# EAGLE design Taciturn_Fuzz (EAGLE 9.6.0)
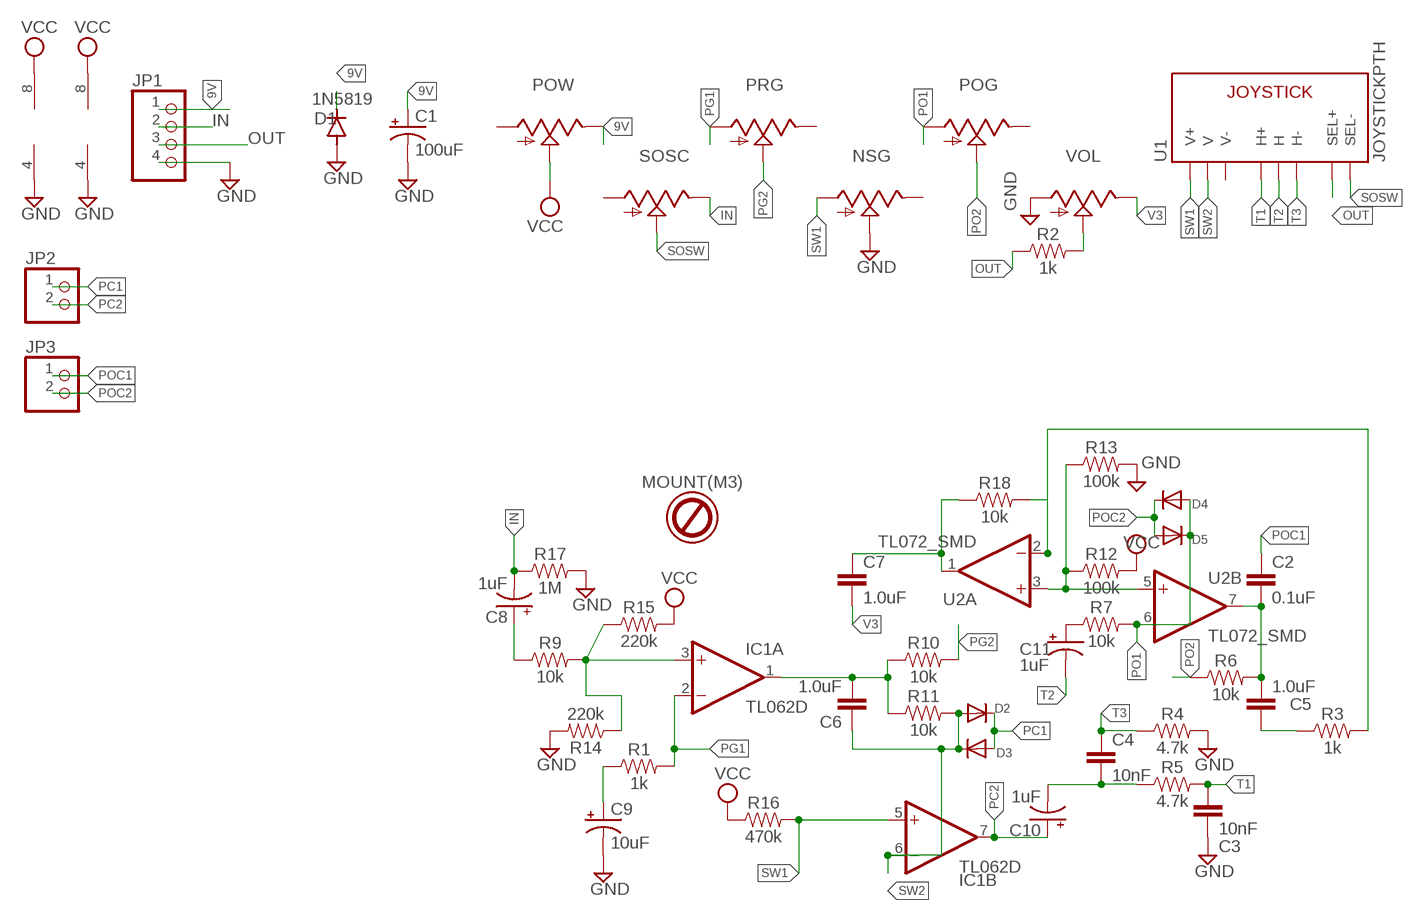
[diagram p0: schematic, sheet 1]

## Parts
C1  100uF  CAP_SMD+THRUPAN_B  [PAN_B_SMD+THRU]
C2  0.1uF  0.1UF-0603-25V-(+80/-20%)  [0603]
C3  10nF  10NF-0603-50V-10%  [0603]
C4  10nF  10NF-0603-50V-10%  [0603]
C5  1.0uF  1.0UF-0603-16V-10%  [0603]
C6  1.0uF  1.0UF-0603-16V-10%  [0603]
C7  1.0uF  1.0UF-0603-16V-10%  [0603]
C8  1uF  CAP_SMD+THRUPAN_B  [PAN_B_SMD+THRU]
C9  10uF  CAP_SMD+THRUPAN_B  [PAN_B_SMD+THRU]
C10  1uF  CAP_SMD+THRUPAN_B  [PAN_B_SMD+THRU]
C11  1uF  CAP_SMD+THRUPAN_B  [PAN_B_SMD+THRU]
D1  1N5819  DIODE-SOD123  [SOD123]
D2  DIODESMA  [SMADIODE]
D3  DIODESMA  [SMADIODE]
D4  DIODESMA  [SMADIODE]
D5  DIODESMA  [SMADIODE]
IC1  TL062D  [SO08]
JP1  PINHD-1X4  [1X04]
JP2  PINHD-1X2  [1X02]
JP3  PINHD-1X2  [1X02]
NSG  9MM_SNAP-IN_POT_  [9MM_SNAP-IN_POT]
O1  MOUNT(M3)  [HOLE-3.5MM]
POG  9MM_SNAP-IN_POT_  [9MM_SNAP-IN_POT]
POW  9MM_SNAP-IN_POT_  [9MM_SNAP-IN_POT]
PRG  9MM_SNAP-IN_POT_  [9MM_SNAP-IN_POT]
R1  1k  1KOHM-0603-1/10W-1%  [0603]
R2  1k  1KOHM-0603-1/10W-1%  [0603]
R3  1k  1KOHM-0603-1/10W-1%  [0603]
R4  4.7k  4.7KOHM-0603-1/10W-1%  [0603]
R5  4.7k  4.7KOHM-0603-1/10W-1%  [0603]
R6  10k  10KOHM-0603-1/10W-1%  [0603]
R7  10k  10KOHM-0603-1/10W-1%  [0603]
R9  10k  10KOHM-0603-1/10W-1%  [0603]
R10  10k  10KOHM-0603-1/10W-1%  [0603]
R11  10k  10KOHM-0603-1/10W-1%  [0603]
R12  100k  100KOHM-0603-1/10W-1%  [0603]
R13  100k  100KOHM-0603-1/10W-1%  [0603]
R14  220k  220KOHM-0603-1/10W-1%  [0603]
R15  220k  220KOHM-0603-1/10W-1%  [0603]
R16  470k  470OHM-0603-1/10W-1%  [0603]
R17  1M  1MOHM-0603-1/4W-5%  [0603]
R18  10k  10KOHM-0603-1/10W-1%  [0603]
SOSC  9MM_SNAP-IN_POT_  [9MM_SNAP-IN_POT]
U1  JOYSTICKPTH  [JOYSTICK]
U2  TL072_SMD  [SO08]
VOL  9MM_SNAP-IN_POT_  [9MM_SNAP-IN_POT]

## Nets
9V: C1.+ C1.++(+) D1.C JP1.1 POW.3(E)
GND: C1.- C1.--(-) C3.2 C9.- C9.--(-) D1.A IC1.4(P:V-) JP1.4 NSG.2(S) R4.2 R13.2 R14.2 R17.2 U2.4(P:V-) VOL.1(A)
IN: C8.- C8.--(-) JP1.2 R17.1 SOSC.3(E)
N$1: R3.2 R18.2 U2.2(A:-IN)
N$2: C8.+ C8.++(+) R9.1
N$3: IC1.3(A:+IN) R9.2 R14.1 R15.1
N$4: C9.+ C9.++(+) R1.1
N$5: C6.2 IC1.1(A:OUT) R10.1 R11.1
N$6: C4.2 C10.- C10.--(-) R5.1
N$7: C11.+ C11.++(+) R7.1
N$8: C2.2 C5.1 R6.2 U2.7(B:OUT)
N$9: C5.2 R3.1
N$10: R12.1 R13.1 U2.3(A:+IN) U2.5(B:+IN)
N$11: C7.1 R18.1 U2.1(A:OUT)
OUT: JP1.3 R2.1 U1.B1A(SEL+)
PC1: D2.C D3.A JP2.1
PC2: C10.+ C10.++(+) IC1.7(B:OUT) JP2.2
PG1: IC1.2(A:-IN) PRG.1(A) R1.2
PG2: PRG.2(S) R10.2
PO1: D4.A D5.C POG.1(A) R7.2 U2.6(B:-IN)
PO2: POG.2(S) R6.1
POC1: C2.1 JP3.1
POC2: D4.C D5.A JP3.2
SOSW: SOSC.2(S) U1.B2A(SEL-)
SW1: IC1.5(B:+IN) NSG.1(A) R16.2 U1.V1(V+)
SW2: C6.1 D2.A D3.C IC1.6(B:-IN) R11.2 U1.V2(V)
T1: C3.1 R5.2 U1.H1(H+)
T2: C11.- C11.--(-) U1.H2(H)
T3: C4.1 R4.1 U1.H3(H-)
V2: R2.2 VOL.2(S)
V3: C7.2 VOL.3(E)
VCC: IC1.8(P:V+) POW.2(S) R12.2 R15.2 R16.1 U2.8(P:V+)
Unconnected: NSG.3(E) O1.MNT POG.3(E) POW.1(A) PRG.3(E) SOSC.1(A) U1.V3(V-)

## Library data of the parts
C1 C8-C11 = MusicThingModular:CAP_SMD+THRU
C2 = SparkFun-Capacitors:0.1UF: 0.1µF ceramic capacitors A capacitor is a passive two-terminal electrical component used to store electrical energy temporarily in an electric field.; PROD_ID: CAP-00810
C3 C4 = SparkFun-Capacitors:10NF: 0.01uF/10nF/10,000pF ceramic capacitors A capacitor is a passive two-terminal electrical component used to store electrical energy temporarily in an electric field. CAP-09321; PROD_ID: CAP-00867
C5-C7 = SparkFun-Capacitors:1.0UF: 1µF ceramic capacitors A capacitor is a passive two-terminal electrical component used to store electrical energy temporarily in an electric field.; PROD_ID: CAP-00868
D1 = diode:DIODE-: DIODE
D2-D5 = adafruit:DIODE: Diode SMADIODE - SMA Surface Mount Package 20V 1A Schottky Diode Digikey: 641-1014-6-ND DO-1N4148 - Through Hole Small Current Diode SOD-123 20V 1 A (.5mV Vf) Schottky Diode - Digikey: MBRX120TPMSCT-ND SOD-323 10V 570mA (.38mV Vf, 3ns) Schottky Diode - Digikey: ZLLS410CT-ND SOD-523 30V 30mA Schottky Diode (RB751S-40TE61) - Digikey: RB751S-40TE61CT-ND SOT23-R/W - SOT23 Package (R = Solder Paste/Reflow Ovens, W = Hand-Soldering) BAT54Film 40V 300mA - Digikey: 497-7162-1-ND
IC1 = linear:TL062: OP AMP
JP1 = Connector:PINHD-1X4: PIN HEADER; CATEGORY: CONNECTOR; SUB-CATEGORY: PIN-HEADER
JP2 JP3 = pinhead:PINHD-1X2: PIN HEADER
NSG POG POW PRG SOSC VOL = MusicThingModular:9MM_SNAP-IN_POT: 9mm vertical snap-in pot, Alpha / Panasonic style
O1 = hardware:MOUNT(?)
R1-R3 = SparkFun-Resistors:1KOHM: 1kΩ resistor A resistor is a passive two-terminal electrical component that implements electrical resistance as a circuit element. Resistors act to reduce current flow, and, at the same time, act to lower voltage levels within circuits. - Wikipedia; PROD_ID: RES-07856
R4 R5 = SparkFun-Resistors:4.7KOHM: 4.7kΩ resistor A resistor is a passive two-terminal electrical component that implements electrical resistance as a circuit element. Resistors act to reduce current flow, and, at the same time, act to lower voltage levels within circuits. - Wikipedia; PROD_ID: RES-07857
R6 R7 R9-R11 R18 = SparkFun-Resistors:10KOHM: 10kΩ resistor A resistor is a passive two-terminal electrical component that implements electrical resistance as a circuit element. Resistors act to reduce current flow, and, at the same time, act to lower voltage levels within circuits. - Wikipedia; PROD_ID: RES-00824
R12 R13 = SparkFun-Resistors:100KOHM: 100kΩ resistor A resistor is a passive two-terminal electrical component that implements electrical resistance as a circuit element. Resistors act to reduce current flow, and, at the same time, act to lower voltage levels within circuits. - Wikipedia; PROD_ID: RES-07828
R14 R15 = SparkFun-Resistors:220KOHM: 220kΩ resistor A resistor is a passive two-terminal electrical component that implements electrical resistance as a circuit element. Resistors act to reduce current flow, and, at the same time, act to lower voltage levels within circuits. - Wikipedia; PROD_ID: RES-08969
R16 = SparkFun-Resistors:470OHM: 470Ω resistor A resistor is a passive two-terminal electrical component that implements electrical resistance as a circuit element. Resistors act to reduce current flow, and, at the same time, act to lower voltage levels within circuits. - Wikipedia; PROD_ID: RES-07869; VALUE: 470
R17 = SparkFun-Resistors:1MOHM: 1MΩ resistor A resistor is a passive two-terminal electrical component that implements electrical resistance as a circuit element. Resistors act to reduce current flow, and, at the same time, act to lower voltage levels within circuits. - Wikipedia; PROD_ID: RES-07868
U1 = SparkFun-Electromechanical:JOYSTICK: Thumb Joystick Joystick commonly found in PS2 controllers. Two pots and a select switch. Footprint proven. Spark Fun Electronics SKU : COM-09032
U2 = MusicThingModular:TL072: Generic Dual Op Amp

## Board
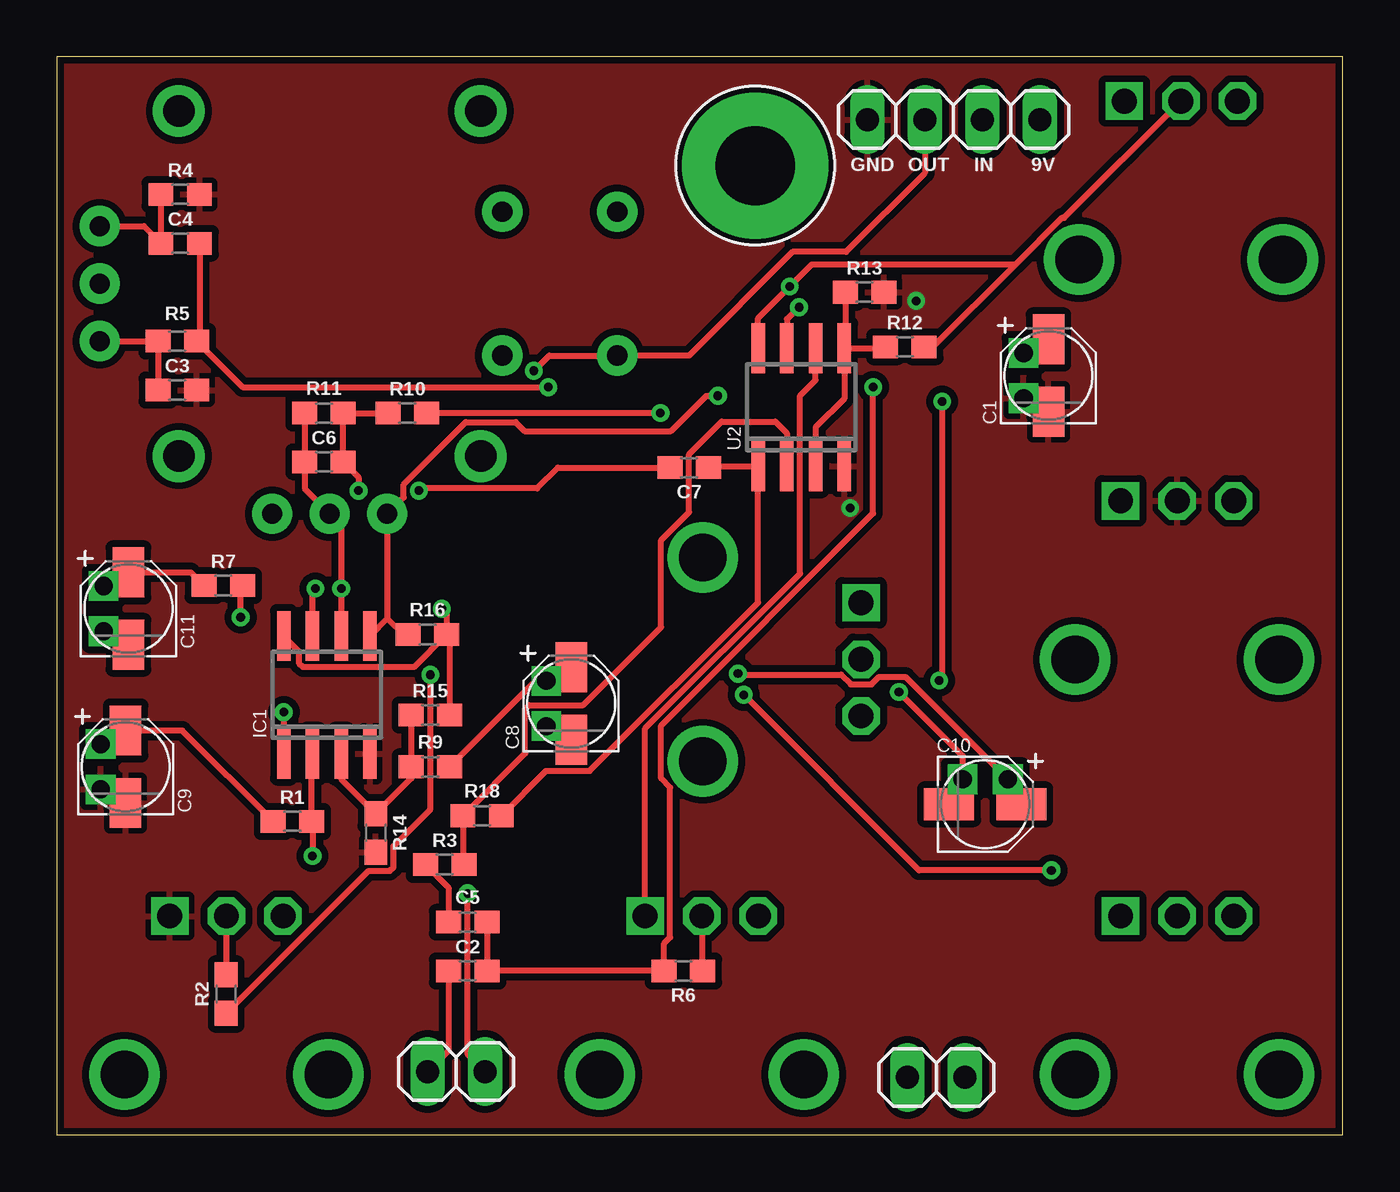
[diagram p1: board, top side]
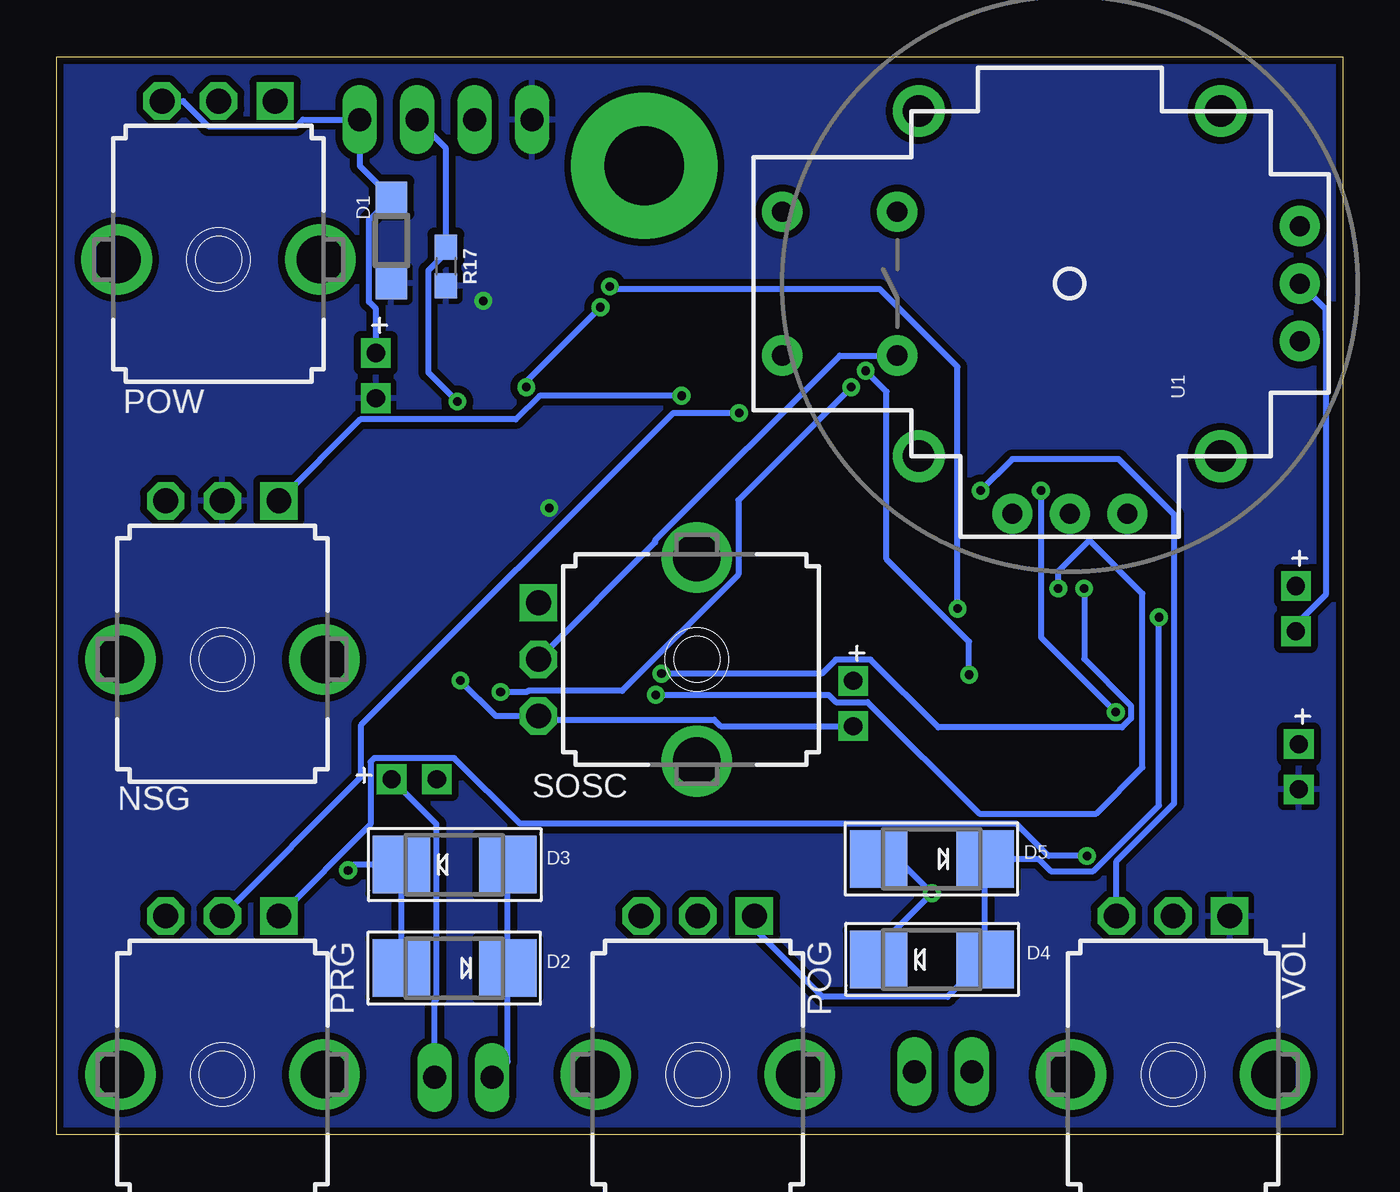
[diagram p2: board, bottom side, seen from below]

Size 56.82 x 47.62 mm. Coordinates in mm from the lower left corner, seen from the top.
Outline: 0,0 56.82,0 56.82,47.62 0,47.62 0,0
Copper layers (1*16): Top 0.035mm / dielectric 1.5mm / Bottom 0.035mm
Design rules "default *": minimum track width 6mil, minimum drill 0.35mm, track to track 6mil, track to pad 6mil, pad to pad 6mil, via to via 6mil, smd to smd 6mil, copper to edge 6mil, drill to drill 6mil, minimum pad ring 10mil, minimum via ring 8mil, stop-mask expansion 4mil, vias tented up to drill 0mil, thermal gap 10mil

### Footprints (pad centres in the part's own frame; a part is rotated, then mirrored left to right if it is on the bottom)
PAN_B_SMD+THRU = smd 2.2 x 1.4: + 1.6,0; - -1.6,0 | drill 0.8 pad 0.9 square: ++ 1,1.1; -- -1,1.1
0603 = smd 1.1 x 1: 1 -0.85,0; 2 0.85,0
SOD123 = smd 1.4 x 1.4: A 1.9,0; C -1.9,0
SMADIODE = smd 2.54 x 2.54: A 2.349,0; C -2.349,0
SO08 = smd 0.6 x 2.2: 1 -1.905,-2.6; 2 -0.635,-2.6; 3 0.635,-2.6; 4 1.905,-2.6; 5 1.905,2.6; 6 0.635,2.6; 7 -0.635,2.6; 8 -1.905,2.6
1X04 = drill 1.016 long: 1 -3.81,0; 2 -1.27,0; 3 1.27,0; 4 3.81,0
1X02 = drill 1.016 long: 1 -1.27,0; 2 1.27,0
9MM_SNAP-IN_POT = drill 1.1 square: 1 -2.5,-7 | drill 1.1 octagon: 2 0,-7; 3 2.5,-7 | drill 2.1 pad 2.794: CHASSIS1 -4.5,0; CHASSIS2 4.5,0
HOLE-3.5MM = drill 3.5 pad 6.452: MNT 0,0
JOYSTICK = drill 0.9 pad 1.778: B1A -3.175,12.7; B1B 3.175,12.7; B2A -3.175,7.62; B2B 3.175,7.62 | drill 0.889 pad 1.778: H1 -2.54,-10.16; H2 0,-10.16; H3 2.54,-10.16; V1 -10.16,2.54; V2 -10.16,0; V3 -10.16,-2.54 | drill 1.397 pad 2.286: MOUNT1 -7.62,6.668; MOUNT2 -7.62,-6.668; MOUNT3 7.62,-6.668; MOUNT4 7.62,6.668

### Placement (x,y rotation side)
C1  43.81,33.53 90 top
C2  18.16,7.24 0 top
C3  5.33,32.89 0 top
C4  5.46,39.37 0 top
C5  18.16,9.4 180 top
C6  11.81,29.72 0 top
C7  27.94,29.46 180 top
C8  22.73,19.05 90 top
C9  3.05,16.26 90 top
C10  41.02,14.61 0 top
C11  3.17,23.24 90 top
D1  42.04,39.5 270 bottom
D2  39.24,7.37 180 bottom
D3  39.24,11.94 0 bottom
D4  18.16,7.75 0 bottom
D5  18.16,12.19 180 bottom
IC1  11.94,19.43 0 top
JP1  39.62,44.83 180 top
JP2  38.86,2.54 0 top
JP3  17.65,2.79 0 top
NSG  49.5,21 180 bottom
O1  30.86,42.8 0 top
POG  28.5,2.67 180 bottom
POW  49.66,38.65 180 bottom
PRG  49.5,2.67 180 bottom
R1  10.41,13.84 0 top
R2  7.49,6.22 90 top
R3  17.14,11.94 0 top
R4  5.46,41.53 0 top
R5  5.33,35.05 180 top
R6  27.69,7.24 180 top
R7  7.37,24.26 0 top
R9  16.51,16.26 180 top
R10  15.49,31.88 0 top
R11  11.81,31.88 180 top
R12  37.47,34.8 0 top
R13  35.69,37.21 0 top
R14  14.1,13.34 270 top
R15  16.51,18.54 0 top
R16  16.38,22.1 180 top
R17  39.62,38.35 270 bottom
R18  18.8,14.1 180 top
SOSC  28.54,21 270 bottom
U1  12.06,37.59 90 bottom
U2  32.89,32.13 0 top
VOL  7.5,2.67 180 bottom

### Tracks (layer width: path | path; a pad name or v marks a point on that pad's centre or on a via)
9V
  Top 0.254: C1.+ 43.22,34.53 C1.++
  Bottom 0.254: C1.++ 42.72,36.48 43.02,36.78 43.02,40.42 D1.C 43.43,42.79 JP1.1 45.94,44.83 46.22,44.55 50.12,44.55 51.23,45.65 POW.3
GND  (via drill 0.38)
  other vias: 37.97,36.83 35.05,27.69
  pour Bottom (isolate 0.305): -1.52,48.39 -1.52,-0.89 -1.14,-1.27 57.15,-1.27 58.29,-0.13 58.29,47.37 57.28,48.39
  pour Top (isolate 0.305): -1.52,48.39 -1.52,-0.25 -0.51,-1.27 57.02,-1.27 58.29,0 58.29,46.74 56.77,48.26 56.64,48.39
IN  (via drill 0.38)
  Top 0.254: C8.- 22.23,17.45 C8.-- | v39.12,32.38 39.12,20.19 v38.99,20.07
  Bottom 0.254: C8.-- 27.49,18.05 27.78,18.34 35.38,18.34 SOSC.3 37.42,18.5 v38.99,20.07 | JP1.2 39.62,43.56 R17.1 39.62,38.95 40.4,38.17 40.4,33.67 v39.12,32.38
N$1
  Top 0.254: R3.2 17.95,11.99 R18.2 20.7,16.85 20.7,18.82 20.86,18.98 23.26,18.98 26.7,22.42 26.7,26.26 27.94,27.5 27.94,30.06 29.38,31.5 31.75,31.5 32.26,30.99 U2.2
N$2
  Top 0.254: R9.1 21.15,20.05 C8.++ 22.23,20.65 C8.+
N$3
  Top 0.254: R15.1 R9.2 15.66,15.75 R14.1 12.57,15.71 IC1.3
N$4
  Top 0.254: R1.1 5.55,17.86 C9.+ 2.45,17.26 C9.++
N$5  (via drill 0.38)
  Top 0.254: R10.1 R11.1 C6.2 13.34,29.04 v13.34,28.45 | v10.03,18.67 IC1.1
  Bottom 0.254: v13.34,28.45 13.34,21.97 v10.03,18.67
N$6  (via drill 0.38)
  Top 0.254: C4.2 6.31,35.18 R5.1 8.22,33.02 v21.72,33.02 | v37.21,19.56 40.02,16.75 C10.-- 39.42,15.11 C10.-
  Bottom 0.254: v37.21,19.56 36.04,19.56 35.99,19.6 31.84,19.6 26.7,24.74 26.7,28.04 v21.72,33.02
N$7
  Top 0.254: C11.++ 2.58,24.24 C11.+ 5.93,24.84 R7.1
N$8  (via drill 0.38)
  Top 0.254: C5.1 C2.2 R6.2 26.84,8.46 27.1,8.73 27.1,15.34 26.7,15.74 26.7,18.07 36.07,27.44 v36.07,33.02 | v32.8,36.55 32.29,36.04 32.26,36.04 U2.7
  Bottom 0.254: v36.07,33.02 36.07,33.27 v32.8,36.55
N$9
  Top 0.254: C5.2 17.31,10.92 R3.1
N$10
  Top 0.254: U2.5 36.55,34.73 R12.1 | R13.1 34.84,34.77 U2.5 | U2.5 34.8,32.51 33.53,31.24 U2.3
N$11
  Top 0.254: C7.1 28.86,29.53 U2.1 30.99,23.51 23.55,16.07 21.62,16.07 R18.1
OUT  (via drill 0.38)
  Top 0.254: v16.51,20.32 16.51,14.39 14.88,12.76 14.88,11.82 14.71,11.66 13.78,11.66 R2.1 | v21.08,33.74 21.75,34.42 U1.B1A 27.94,34.42 32.51,38.99 34.87,38.99 38.35,42.47 JP1.3
  Bottom 0.254: v16.51,20.32 16.51,21.78 20.16,25.43 20.16,32.82 v21.08,33.74
PC1
  Bottom 0.254: JP2.1 36.89,3.24 D2.C D3.A
PC2  (via drill 0.38)
  Top 0.254: C10.+ 42.62,15.11 42.13,15.59 C10.++ 37.49,20.23 36.33,20.23 35.99,19.9 35.08,19.9 34.66,20.32 30.15,20.32 v30.1,20.37 | IC1.7 11.3,24 v11.43,24.13
  Bottom 0.254: JP2.2 40.13,5.89 40.04,5.98 40.04,13.73 C10.++ | v30.1,20.37 23.02,20.37 22.4,20.98 20.86,20.98 17.88,18 9.75,18 9.36,18.39 9.36,18.95 11.43,21.02 v11.43,24.13
PG1  (via drill 0.38)
  Top 0.254: IC1.2 11.26,16.79 R1.2 11.3,13.8 v11.3,12.32
  Bottom 0.254: v11.3,12.32 13,12.32 14.43,13.74 36.35,13.74 39.25,16.64 42.79,16.64 42.95,16.48 42.95,13.71 PRG.1
PG2  (via drill 0.38)
  Top 0.254: v26.67,31.88 R10.2
  Bottom 0.254: PRG.2 43.36,15.81 43.36,18.1 29.59,31.88 v26.67,31.88
PO1  (via drill 0.38)
  Top 0.254: v8.13,22.86 8.13,24.17 R7.2 | POG.1 26,17.95 32.84,24.79 32.84,32.64 33.53,33.33 U2.6
  Bottom 0.254: v8.13,22.86 8.13,14.54 11.02,11.65 12.9,11.65 13.45,12.19 D5.C D4.A 17.46,6.1 22.99,6.1 26,9.11 POG.1
PO2
  Top 0.254: POG.2 28.5,7.28 R6.1
POC1
  Top 0.254: C2.1 17.31,3.72 JP3.1
POC2  (via drill 0.38)
  Top 0.254: JP3.2 18.16,3.56 v18.16,10.67
  Bottom 0.254: D5.A 19.68,12.19 v18.16,10.67 20.51,8.32 D4.C
SOSW
  Bottom 0.254: SOSC.2 30.38,26.16 30.38,26.26 22.22,34.42 U1.B2A
SW1  (via drill 0.38)
  Top 0.254: 14.61,22.79 U1.V1 15.33,28.16 15.33,28.73 18.07,31.47 20.28,31.47 20.68,31.08 27.14,31.08 28.7,32.64 v29.21,32.64 | 14.61,22.79 IC1.5 | 14.61,22.79 15.3,22.1 R16.2
  Bottom 0.254: v29.21,32.64 35.5,32.64 36.54,31.59 43.41,31.59 NSG.1
SW2  (via drill 0.38)
  Top 0.254: R11.2 C6.1 10.96,28.54 U1.V2 12.57,26.92 v12.57,24.13 IC1.6 | v43.94,11.68 38.1,11.68 v30.35,19.43
  Bottom 0.254: D2.A D3.C 43.69,11.94 v43.94,11.68 | v30.35,19.43 22.72,19.43 22.4,19.12 21,19.12 16.07,14.19 10.9,14.19 8.85,16.23 8.85,23.9 11.21,26.26 12.57,24.89 v12.57,24.13
T1
  Top 0.254: U1.H1 R5.2 C3.1
T2
  Top 0.254: C11.- 2.67,21.64 C11.--
  Bottom 0.254: C11.-- 2.08,22.54 0.74,23.88 0.74,35.54 0.76,35.56 0.76,36.45 U1.H2
T3
  Top 0.254: U1.H3 3.85,40.13 C4.1 R4.1
V2
  Top 0.254: VOL.2 R2.2
V3  (via drill 0.38)
  Top 0.254: v16,28.45 16.1,28.55 21.23,28.55 22.14,29.46 C7.2
  Bottom 0.254: VOL.3 10,12.1 7.46,14.64 7.46,27.39 9.91,29.84 14.61,29.84 v16,28.45
VCC  (via drill 0.38)
  Top 0.254: POW.2 44.5,40.49 44.4,40.49 42.34,38.43 | R12.2 38.71,34.8 42.34,38.43 | R16.1 17.36,21.97 R15.2 | IC1.8 10.72,21.34 10.72,20.82 10.89,20.65 15.79,20.65 R16.1 | 42.34,38.43 33.35,38.43 v32.38,37.47 30.99,36.07 U2.8 | v17.02,23.24 17.23,23.03 R16.1
  Bottom 0.254: v17.02,23.24 17.02,33.91 20.47,37.36 32.28,37.36 v32.38,37.47

### Text on the board
tPlace: GND | OUT | IN | 9V